# EAGLE design Preamp_board2 (EAGLE 9.1.2)
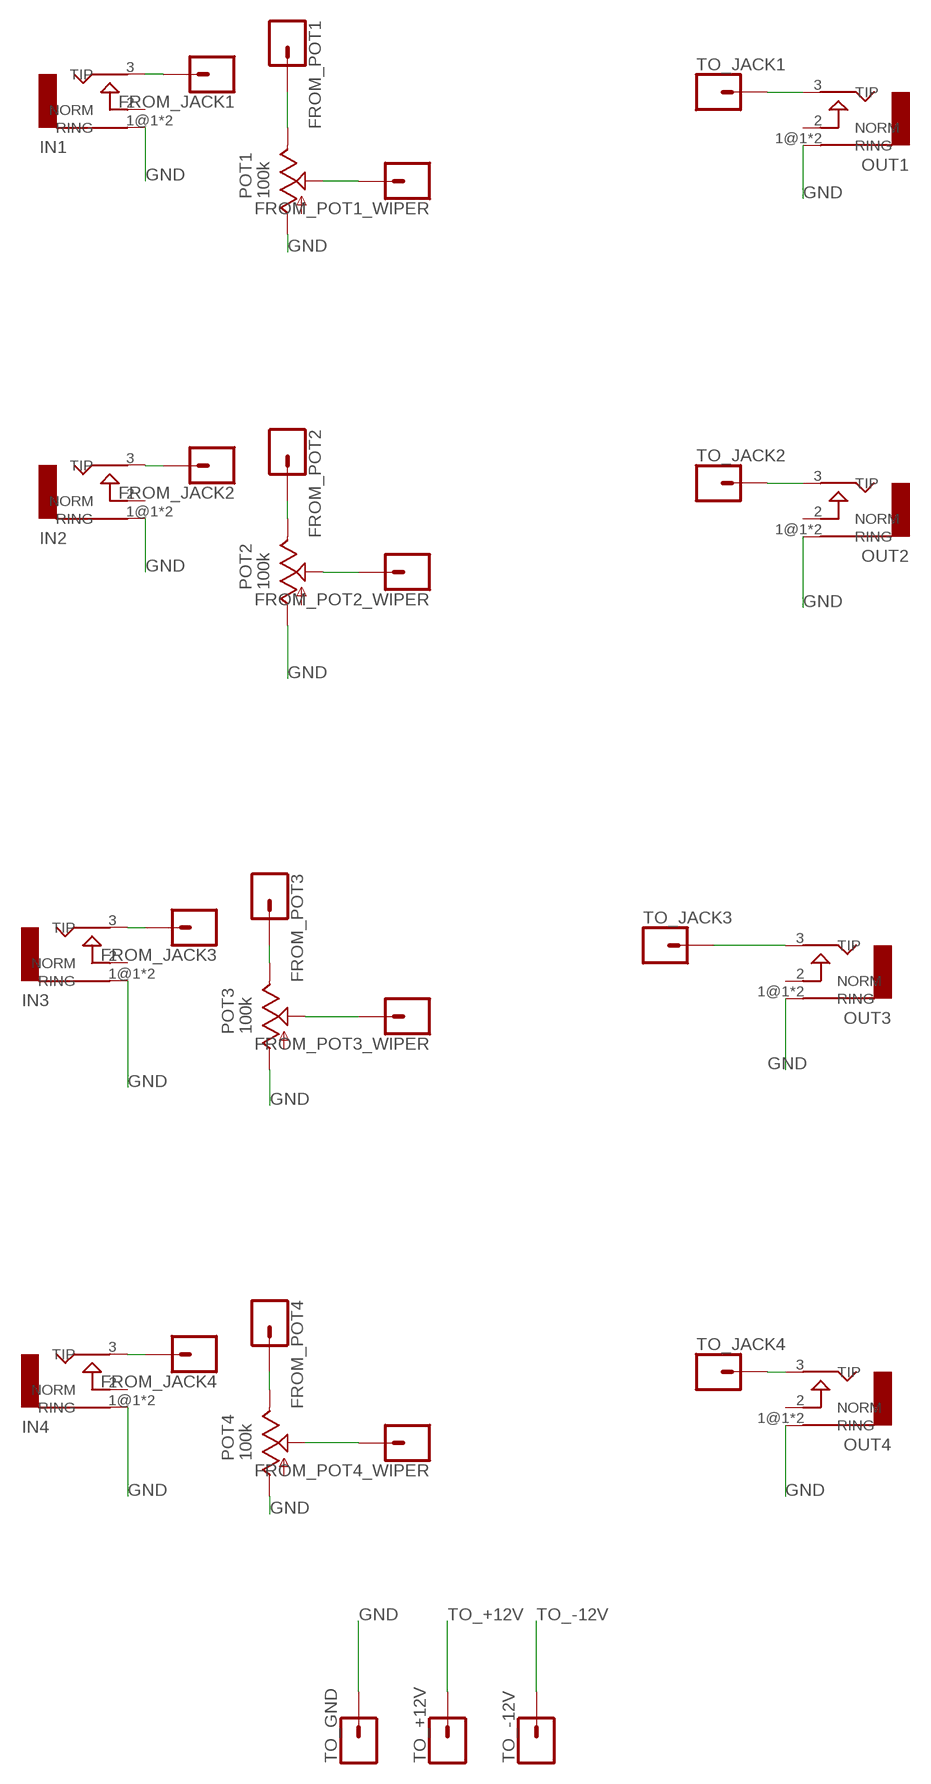
[diagram p0: schematic, sheet 1]

## Parts
FROM_JACK1  CONN_01PTH_LONGPAD  [1X01_LONGPAD]
FROM_JACK2  CONN_01PTH_LONGPAD  [1X01_LONGPAD]
FROM_JACK3  CONN_01PTH_LONGPAD  [1X01_LONGPAD]
FROM_JACK4  CONN_01PTH_LONGPAD  [1X01_LONGPAD]
FROM_POT1  CONN_01PTH_LONGPAD  [1X01_LONGPAD]
FROM_POT1_WIPER  CONN_01PTH_LONGPAD  [1X01_LONGPAD]
FROM_POT2  CONN_01PTH_LONGPAD  [1X01_LONGPAD]
FROM_POT2_WIPER  CONN_01PTH_LONGPAD  [1X01_LONGPAD]
FROM_POT3  CONN_01PTH_LONGPAD  [1X01_LONGPAD]
FROM_POT3_WIPER  CONN_01PTH_LONGPAD  [1X01_LONGPAD]
FROM_POT4  CONN_01PTH_LONGPAD  [1X01_LONGPAD]
FROM_POT4_WIPER  CONN_01PTH_LONGPAD  [1X01_LONGPAD]
IN1  AUDIO-JACKERTHENVAR  [ERTHENVAR-JACK]
IN2  AUDIO-JACKERTHENVAR  [ERTHENVAR-JACK]
IN3  AUDIO-JACKERTHENVAR  [ERTHENVAR-JACK]
IN4  AUDIO-JACKERTHENVAR  [ERTHENVAR-JACK]
OUT1  AUDIO-JACKERTHENVAR  [ERTHENVAR-JACK]
OUT2  AUDIO-JACKERTHENVAR  [ERTHENVAR-JACK]
OUT3  AUDIO-JACKERTHENVAR  [ERTHENVAR-JACK]
OUT4  AUDIO-JACKERTHENVAR  [ERTHENVAR-JACK]
POT1  100k  9MM_SNAP-IN_POT_  [9MM_SNAP-IN_POT]
POT2  100k  9MM_SNAP-IN_POT_  [9MM_SNAP-IN_POT]
POT3  100k  9MM_SNAP-IN_POT_  [9MM_SNAP-IN_POT]
POT4  100k  9MM_SNAP-IN_POT_  [9MM_SNAP-IN_POT]
TO_+12V  CONN_01PTH_LONGPAD  [1X01_LONGPAD]
TO_-12V  CONN_01PTH_LONGPAD  [1X01_LONGPAD]
TO_GND  CONN_01PTH_LONGPAD  [1X01_LONGPAD]
TO_JACK1  CONN_01PTH_LONGPAD  [1X01_LONGPAD]
TO_JACK2  CONN_01PTH_LONGPAD  [1X01_LONGPAD]
TO_JACK3  CONN_01PTH_LONGPAD  [1X01_LONGPAD]
TO_JACK4  CONN_01PTH_LONGPAD  [1X01_LONGPAD]

## Nets
GND: IN1.1@1(RING) IN1.1@2(RING) IN2.1@1(RING) IN2.1@2(RING) IN3.1@1(RING) IN3.1@2(RING) IN4.1@1(RING) IN4.1@2(RING) OUT1.1@1(RING) OUT1.1@2(RING) OUT2.1@1(RING) OUT2.1@2(RING) OUT3.1@1(RING) OUT3.1@2(RING) OUT4.1@1(RING) OUT4.1@2(RING) POT1.1(A) POT2.1(A) POT3.1(A) POT4.1(A) TO_GND.1
N$1: OUT1.3(TIP) TO_JACK1.1
N$2: OUT2.3(TIP) TO_JACK2.1
N$3: OUT3.3(TIP) TO_JACK3.1
N$4: OUT4.3(TIP) TO_JACK4.1
N$5: FROM_POT4.1 POT4.3(E)
N$6: FROM_JACK1.1 IN1.3(TIP)
N$7: FROM_POT2.1 POT2.3(E)
N$8: FROM_JACK2.1 IN2.3(TIP)
N$9: FROM_POT1.1 POT1.3(E)
N$10: FROM_POT2_WIPER.1 POT2.2(S)
N$11: FROM_POT3_WIPER.1 POT3.2(S)
N$12: FROM_POT3.1 POT3.3(E)
N$14: FROM_JACK3.1 IN3.3(TIP)
N$15: FROM_POT4_WIPER.1 POT4.2(S)
N$16: FROM_JACK4.1 IN4.3(TIP)
N$20: FROM_POT1_WIPER.1 POT1.2(S)
TO_+12V: TO_+12V.1
TO_-12V: TO_-12V.1
Unconnected: IN1.2(NORM) IN2.2(NORM) IN3.2(NORM) IN4.2(NORM) OUT1.2(NORM) OUT2.2(NORM) OUT3.2(NORM) OUT4.2(NORM)

## Library data of the parts
FROM_JACK1-FROM_JACK4 FROM_POT1 FROM_POT1_WIPER FROM_POT2 FROM_POT2_WIPER FROM_POT3 FROM_POT3_WIPER FROM_POT4 FROM_POT4_WIPER TO_+12V TO_-12V TO_GND TO_JACK1-TO_JACK4 = SparkFun-Connectors:CONN_01: Single connection point. Often used as Generic Header-pin footprint for 0.1 inch spaced/style header connections On any of the 0.1 inch spaced packages, you can populate with these: Break Away Headers - Straight <https://www.sparkfun.com/products/116> (PRT-00116) Break Away Male Headers - Right Angle <https://www.sparkfun.com/products/553> (PRT-00553) Female Headers <https://www.sparkfun.com/products/115> (PRT-00115) Break Away Headers - Machine Pin <https://www.sparkfun.com/products/117> (PRT-00117) Break Away Female Headers - Swiss Machine Pin <https://www.sparkfun.com/products/743> (PRT-00743) This device is also useful as a general connection point to wire up your design to another part of your project. Our various solder wires solder well into these plated through hole pads. Hook-Up Wire - Assortment (Stranded, 22 AWG) <https://www.sparkfun.com/products/11375> (PRT-11375) Hook-Up Wire - Assortment (Solid Core, 22 AWG) <https://www.sparkfun.com/products/11367> (PRT-11367) View the entire wire category on our website here <https://www.sparkfun.com/categories/141> Special notes: SMTSO-256-ET is a "flush mount" nut for a 4-40 screw. We mostly use this on specialty testbeds; it is a nice way to connect hardware to your PCB at an adjustable hieght. Also note, the SNAP packages are for using a snappable style connector. We sell a baggie of snaps and they are also used on two LilyPad designs: Snap Assortment - 30 pack (male and female) <https://www.sparkfun.com/products/11347> (DEV-11347) LilyPad Arduino SimpleSnap <https://www.sparkfun.com/products/10941> (DEV-10941) LilyPad SimpleSnap Protoboard <https://www.sparkfun.com/products/10940> (DEV-10940)
IN1-IN4 OUT1-OUT4 = erthenvar:AUDIO-JACK: Switching Mono 3.5mm Audio Jack from Erthenvar.
POT1-POT4 = MusicThingModular:9MM_SNAP-IN_POT: 9mm vertical snap-in pot, Alpha / Panasonic style

## Board
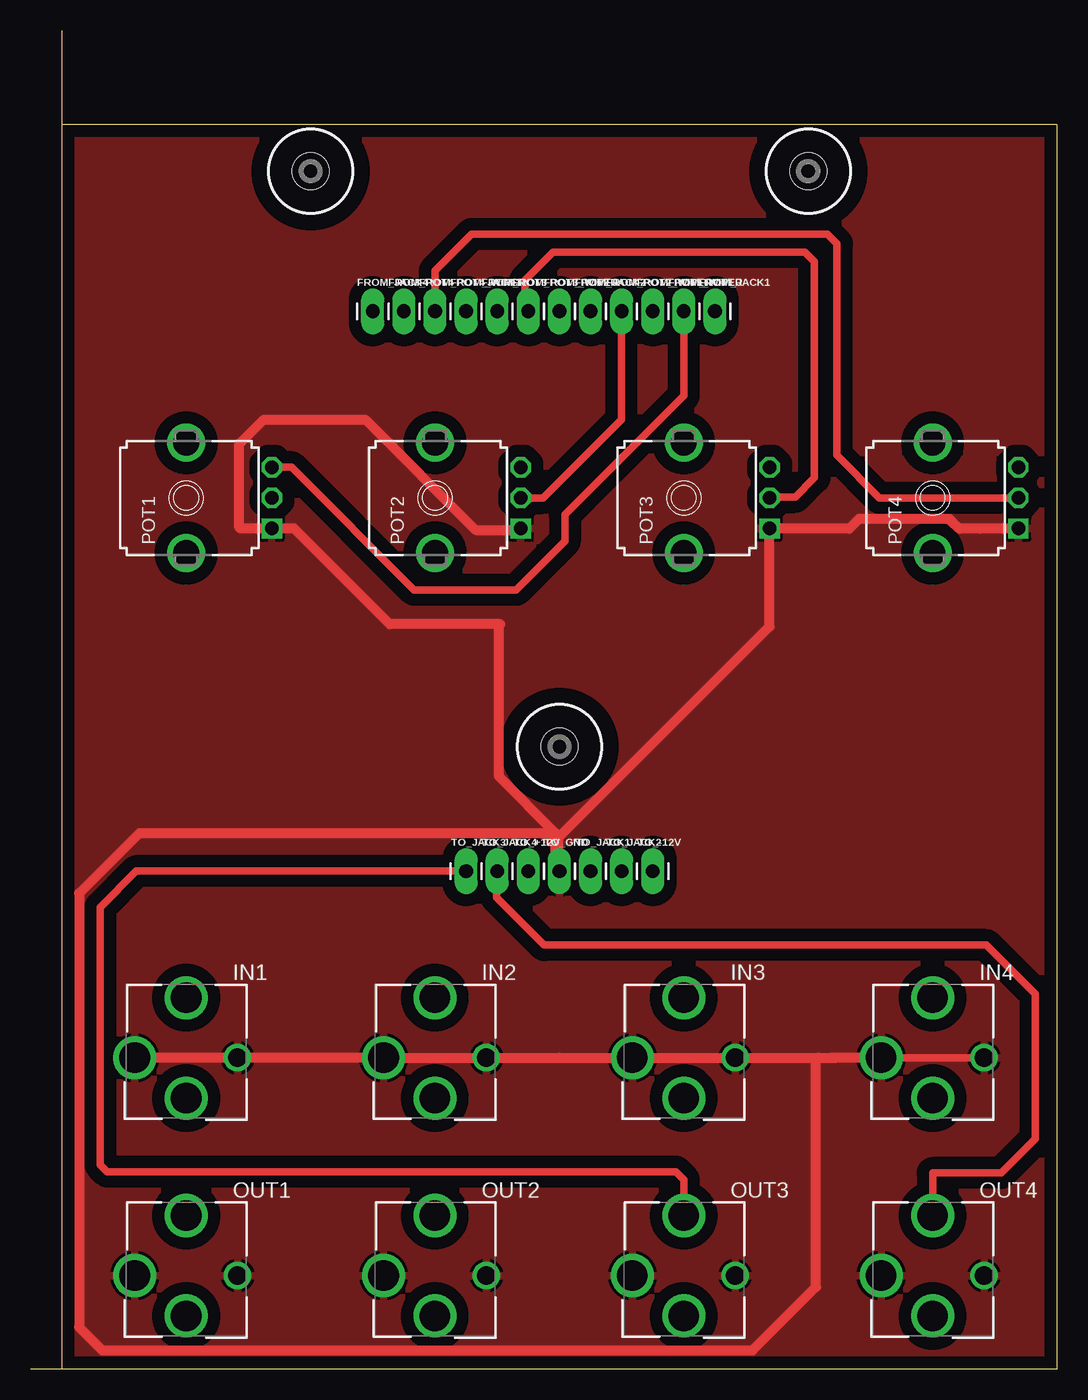
[diagram p1: board, top side]
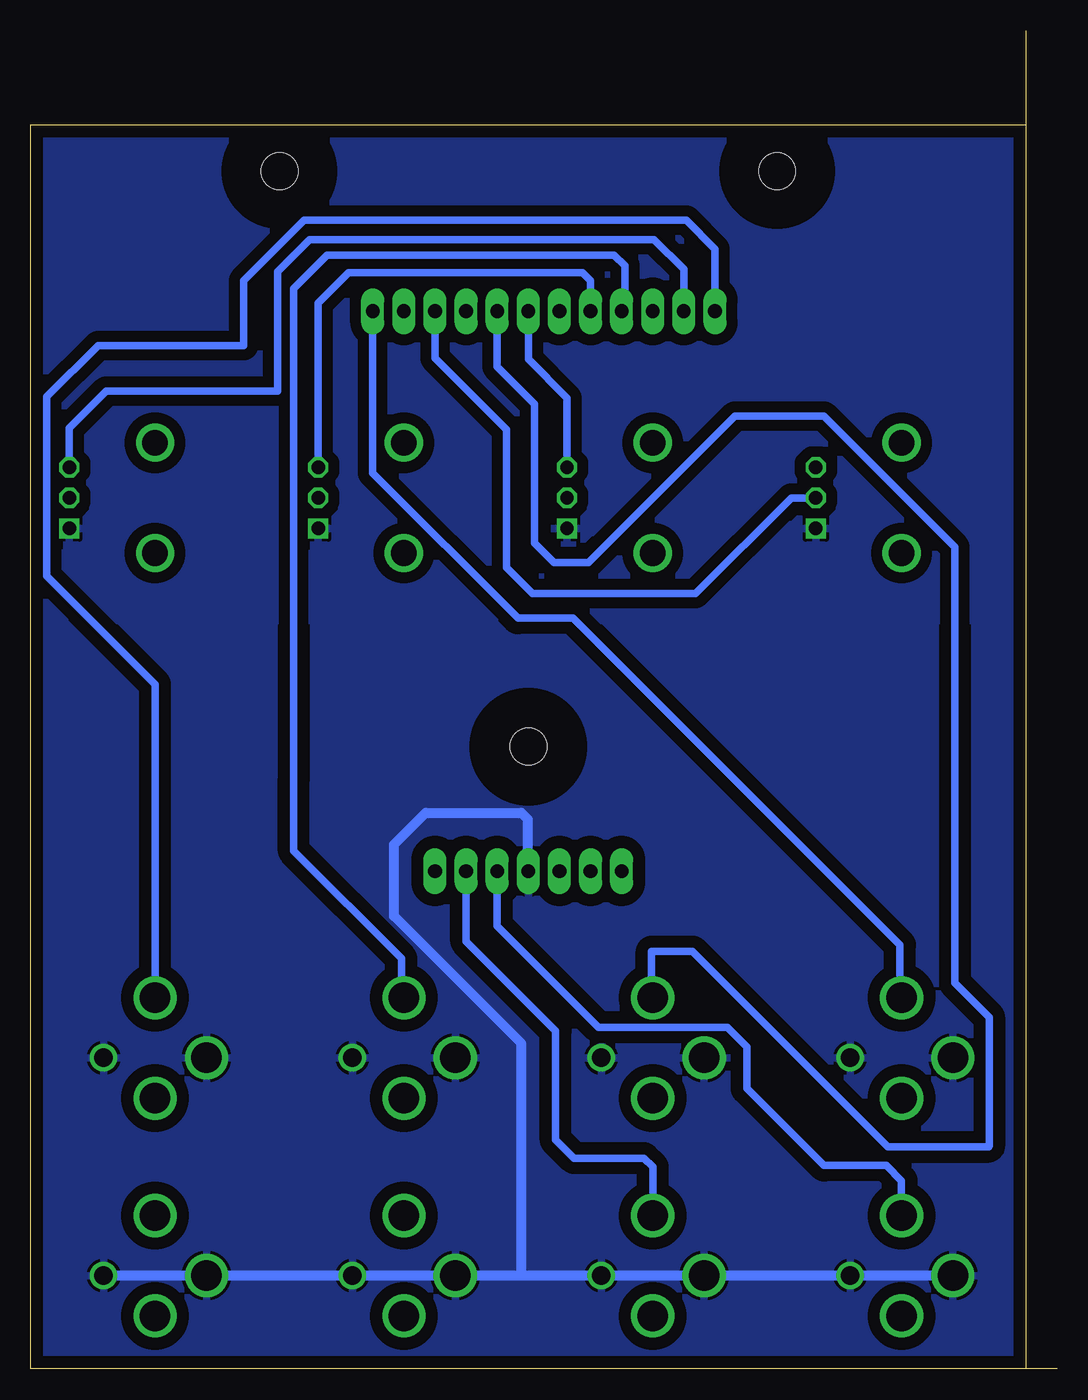
[diagram p2: board, bottom side, seen from below]

Size 83.82 x 109.27 mm. Coordinates in mm from the lower left corner, seen from the top.
Outline: 0,0 83.82,0 83.82,101.6 2.54,101.6
Outline: 2.54,109.27 2.54,0
Copper layers (1*16): Top 0.035mm / dielectric 1.5mm / Bottom 0.035mm
Design rules "default": minimum track width 6mil, minimum drill 0.35mm, track to track 6mil, track to pad 6mil, pad to pad 6mil, via to via 6mil, smd to smd 6mil, copper to edge 40mil, drill to drill 6mil, minimum pad ring 10mil, minimum via ring 8mil, stop-mask expansion 4mil, vias tented up to drill 0mil, thermal gap 10mil

### Footprints (pad centres in the part's own frame; a part is rotated, then mirrored left to right if it is on the bottom)
1X01_LONGPAD = drill 1.118 pad 1.88 long: 1 0,0
DRIL-3 = hole 3: 0,0
ERTHENVAR-JACK = drill 2.5: 1@1 -4.2,0; 2 0,-3.3; 3 0,4.9 | drill 1.5: 1@2 4.2,0
9MM_SNAP-IN_POT = drill 1.1 square: 1 -2.5,-7 | drill 1.1 octagon: 2 0,-7; 3 2.5,-7 | drill 2.1 pad 2.794: CHASSIS1 -4.5,0; CHASSIS2 4.5,0

### Placement (x,y rotation side)
FROM_JACK1  55.88,86.36 0 top
FROM_JACK2  45.72,86.36 0 top
FROM_JACK3  35.56,86.36 0 top
FROM_JACK4  27.94,86.36 0 top
FROM_POT1  53.34,86.36 0 top
FROM_POT1_WIPER  50.8,86.36 0 top
FROM_POT2  43.18,86.36 0 top
FROM_POT2_WIPER  48.26,86.36 0 top
FROM_POT3  38.1,86.36 0 top
FROM_POT3_WIPER  40.64,86.36 0 top
FROM_POT4  30.48,86.36 0 top
FROM_POT4_WIPER  33.02,86.36 0 top
H1  [DRIL-3]  22.86,97.79 0 top
H2  [DRIL-3]  63.5,97.79 0 top
H5  [DRIL-3]  43.18,50.8 0 top
IN1  12.7,25.4 0 top
IN2  33.02,25.4 0 top
IN3  53.34,25.4 0 top
IN4  73.66,25.4 0 top
OUT1  12.7,7.62 0 top
OUT2  33.02,7.62 0 top
OUT3  53.34,7.62 0 top
OUT4  73.66,7.62 0 top
POT1  12.7,71.12 90 top
POT2  33.02,71.12 90 top
POT3  53.34,71.12 90 top
POT4  73.66,71.12 90 top
TO_+12V  40.64,40.64 0 top
TO_-12V  50.8,40.64 0 top
TO_GND  43.18,40.64 0 top
TO_JACK1  45.72,40.64 0 top
TO_JACK2  48.26,40.64 0 top
TO_JACK3  35.56,40.64 0 top
TO_JACK4  38.1,40.64 0 top

### Tracks (layer width: path | path; a pad name or v marks a point on that pad's centre or on a via)
GND
  Top 0.61: IN4.1@1 IN4.1@2
  Top 0.813: 42.88,43.74 42.88,40.94 TO_GND.1 | 42.88,43.74 38.26,48.35 38.26,60.72 38.34,60.8 29.32,60.8 21.5,68.62 POT1.1 | 19.81,68.51 POT1.1 | IN4.1@1 65.79,25.4 | 65.79,25.4 65.38,25.4 | 64.34,25.4 IN3.1@2 IN3.1@1 43.18,25.4 IN2.1@2 IN2.1@1 IN1.1@2 IN1.1@1 | 64.34,25.4 65.79,25.4 | TO_GND.1 43.18,41.84 | TO_GND.1 43.12,40.7 43.12,43.38 60.34,60.6 POT3.1 60.36,68.6 66.84,68.6 67.64,69.4 75.04,69.4 75.24,69.2 75.84,68.6 77.54,68.6 77.56,68.62 POT4.1 | 42.88,43.74 8.88,43.74 3.96,38.82 3.96,3.4 5.86,1.5 58.94,1.5 64.14,6.7 64.14,25.2 64.34,25.4 | POT2.1 39.9,68.5 36.34,68.5 27.34,77.5 19.04,77.5 17.04,75.5 17.04,68.7 17.12,68.62 POT1.1
  Bottom 0.813: OUT1.1@1 OUT1.1@2 OUT2.1@1 OUT2.1@2 43.74,7.62 | 43.74,7.62 OUT3.1@1 OUT3.1@2 OUT4.1@1 OUT4.1@2 | 43.74,7.62 43.74,26.56 54.16,36.98 54.16,42.8 51.56,45.4 43.74,45.4 43.24,44.9 43.24,40.7 TO_GND.1
  pour Bottom (isolate 1): 2.54,101.5 2.64,101.6 2.74,101.5 83.84,101.5 83.84,0.1 83.74,0 2.54,-0.1
  pour Top (isolate 1): 2.54,0 2.54,101.6 83.84,101.6 83.84,0
N$1
  Bottom 0.61: TO_JACK1.1 45.72,36.18 37.44,27.9 26.94,27.9 25.34,26.3 25.34,22.9 19.04,16.6 13.94,16.6 12.7,15.36 OUT1.3 12.9,12.72
N$2
  Bottom 0.61: OUT2.3 33.02,16.48 33.74,17.2 39.44,17.2 40.94,18.7 40.94,27.6 48.26,34.92 TO_JACK2.1
N$3
  Top 0.61: TO_JACK3.1 8.64,40.64 5.69,37.69 5.69,16.67 6.26,16.09 52.69,16.09 53.34,15.44 OUT3.3
N$4
  Top 0.61: 82.04,30.6 82.04,27.8 | 82.04,27.8 82.04,18.8 79.25,16 73.66,16 OUT4.3 | 82.04,27.8 | 82.04,30.6 | 82.04,30.6 78.04,34.6 41.94,34.6 38.04,38.5 38.04,40.58 TO_JACK4.1
N$5
  Bottom 0.61: FROM_POT4.1 30.48,89.78 32.9,92.2 61.04,92.2 63.65,89.59 63.65,79.84 77.65,79.84 80.66,76.84 POT4.3
N$6
  Bottom 0.61: FROM_JACK1.1 55.88,73.14 44.04,61.3 39.54,61.3 12.84,34.6 12.84,30.44 IN1.3
N$7
  Bottom 0.61: POT2.3 40.02,79.28 43.18,82.44 FROM_POT2.1
N$8
  Bottom 0.61: FROM_JACK2.1 45.72,81.83 42.67,78.78 42.67,67.43 41.07,65.83 38.27,65.83 26.3,77.8 19.04,77.8 8.34,67.1 8.34,31.5 5.54,28.7 5.54,18.21 5.6,18.15 13.83,18.15 29.76,34.08 33.12,34.08 33.12,30.4 IN2.3
N$9
  Top 0.61: FROM_POT1.1 53.34,79.46 43.63,69.74 43.63,67.59 39.64,63.6 31.31,63.6 21.3,73.62 POT1.3
N$10
  Top 0.61: POT2.2 41.86,71.12 48.26,77.52 FROM_POT2_WIPER.1
N$11
  Top 0.61: FROM_POT3_WIPER.1 40.64,86.11 40.39,85.85 40.39,88.9 42.67,91.19 63.25,91.19 64.01,90.42 64.01,72.77 62.44,71.2 60.42,71.2 POT3.2
N$12
  Bottom 0.61: POT3.3 60.34,87 57.84,89.5 38.74,89.5 38.1,88.86 FROM_POT3.1
N$13
  pour Bottom (isolate 0.9): 2.54,61.1 83.84,61.1 83.84,101.6 2.54,101.6
N$14
  Bottom 0.61: FROM_JACK3.1 35.56,86.11 35.31,85.85 35.31,90.06 36.18,90.94 59.62,90.94 62.34,88.22 62.34,48.2 62.34,42.3 53.54,33.5 53.54,30.5 IN3.3
N$15
  Top 0.61: FROM_POT4_WIPER.1 33.02,89.66 36.01,92.66 65.05,92.66 65.84,91.87 65.84,74.6 69.32,71.12 POT4.2
N$16
  Bottom 0.61: IN4.3 73.66,55.88 82.5,64.72 82.5,79.38 78.32,83.57 66.42,83.57 66.42,88.86 61.51,93.78 30.27,93.78 27.94,91.44 FROM_JACK4.1
N$17
  pour Top (isolate 1): 2.64,101.6 2.64,75.6 3.44,74.8 83.84,74.8 83.84,101.5 2.74,101.5
N$18
  pour Top (isolate 1): 83.84,70 66.24,70 66.14,70.1 66.14,74.3 83.74,74.3 83.84,74.2
N$20
  Bottom 0.61: FROM_POT1_WIPER.1 50.8,82.53 44.95,76.68 44.95,65.42 42.83,63.3 29.52,63.3 21.7,71.12 POT1.2

### Text on the board
tDocu: A0 | A7 | 5.5V | GND | D2 | D7